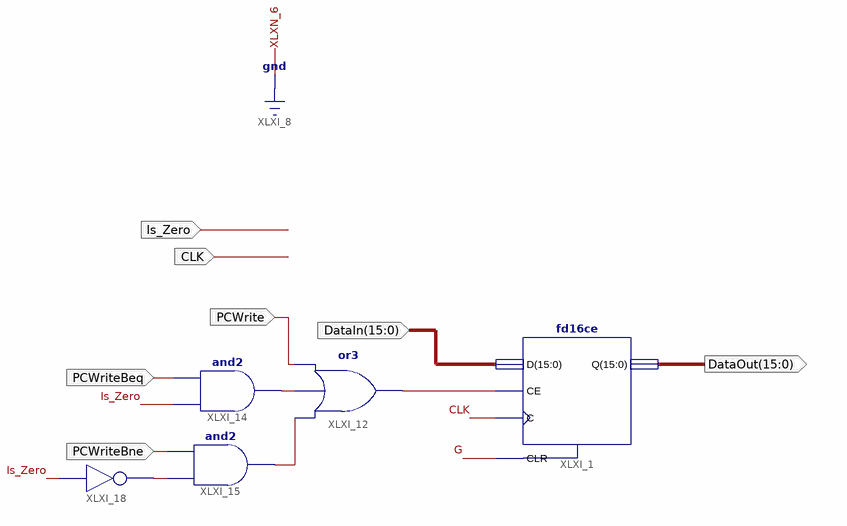
[diagram p0: schematic sheet 1]
// Xilinx ISE schematic PC_Register.sch (spartan3e) as structural Verilog: 5 symbols, 7 ports
module PC_Register (
  input  CLK,
  input  [15:0] DataIn,
  input  PCWrite,
  input  PCWriteBeq,
  input  PCWriteBne,
  input  Is_Zero,
  output [15:0] DataOut
);

  wire G, XLXN_1, XLXN_9, XLXN_12, XLXN_25;

  fd16ce XLXI_1 (.C(CLK), .CE(XLXN_1), .CLR(G), .D(DataIn), .Q(DataOut));
  or XLXI_12 (XLXN_1, XLXN_12, XLXN_9, PCWrite);
  and XLXI_14 (XLXN_9, Is_Zero, PCWriteBeq);
  and XLXI_15 (XLXN_12, XLXN_25, PCWriteBne);
  not XLXI_18 (XLXN_25, Is_Zero);
endmodule
